# Altium schematic sheet POWER_RAIL.SchDoc
size A3
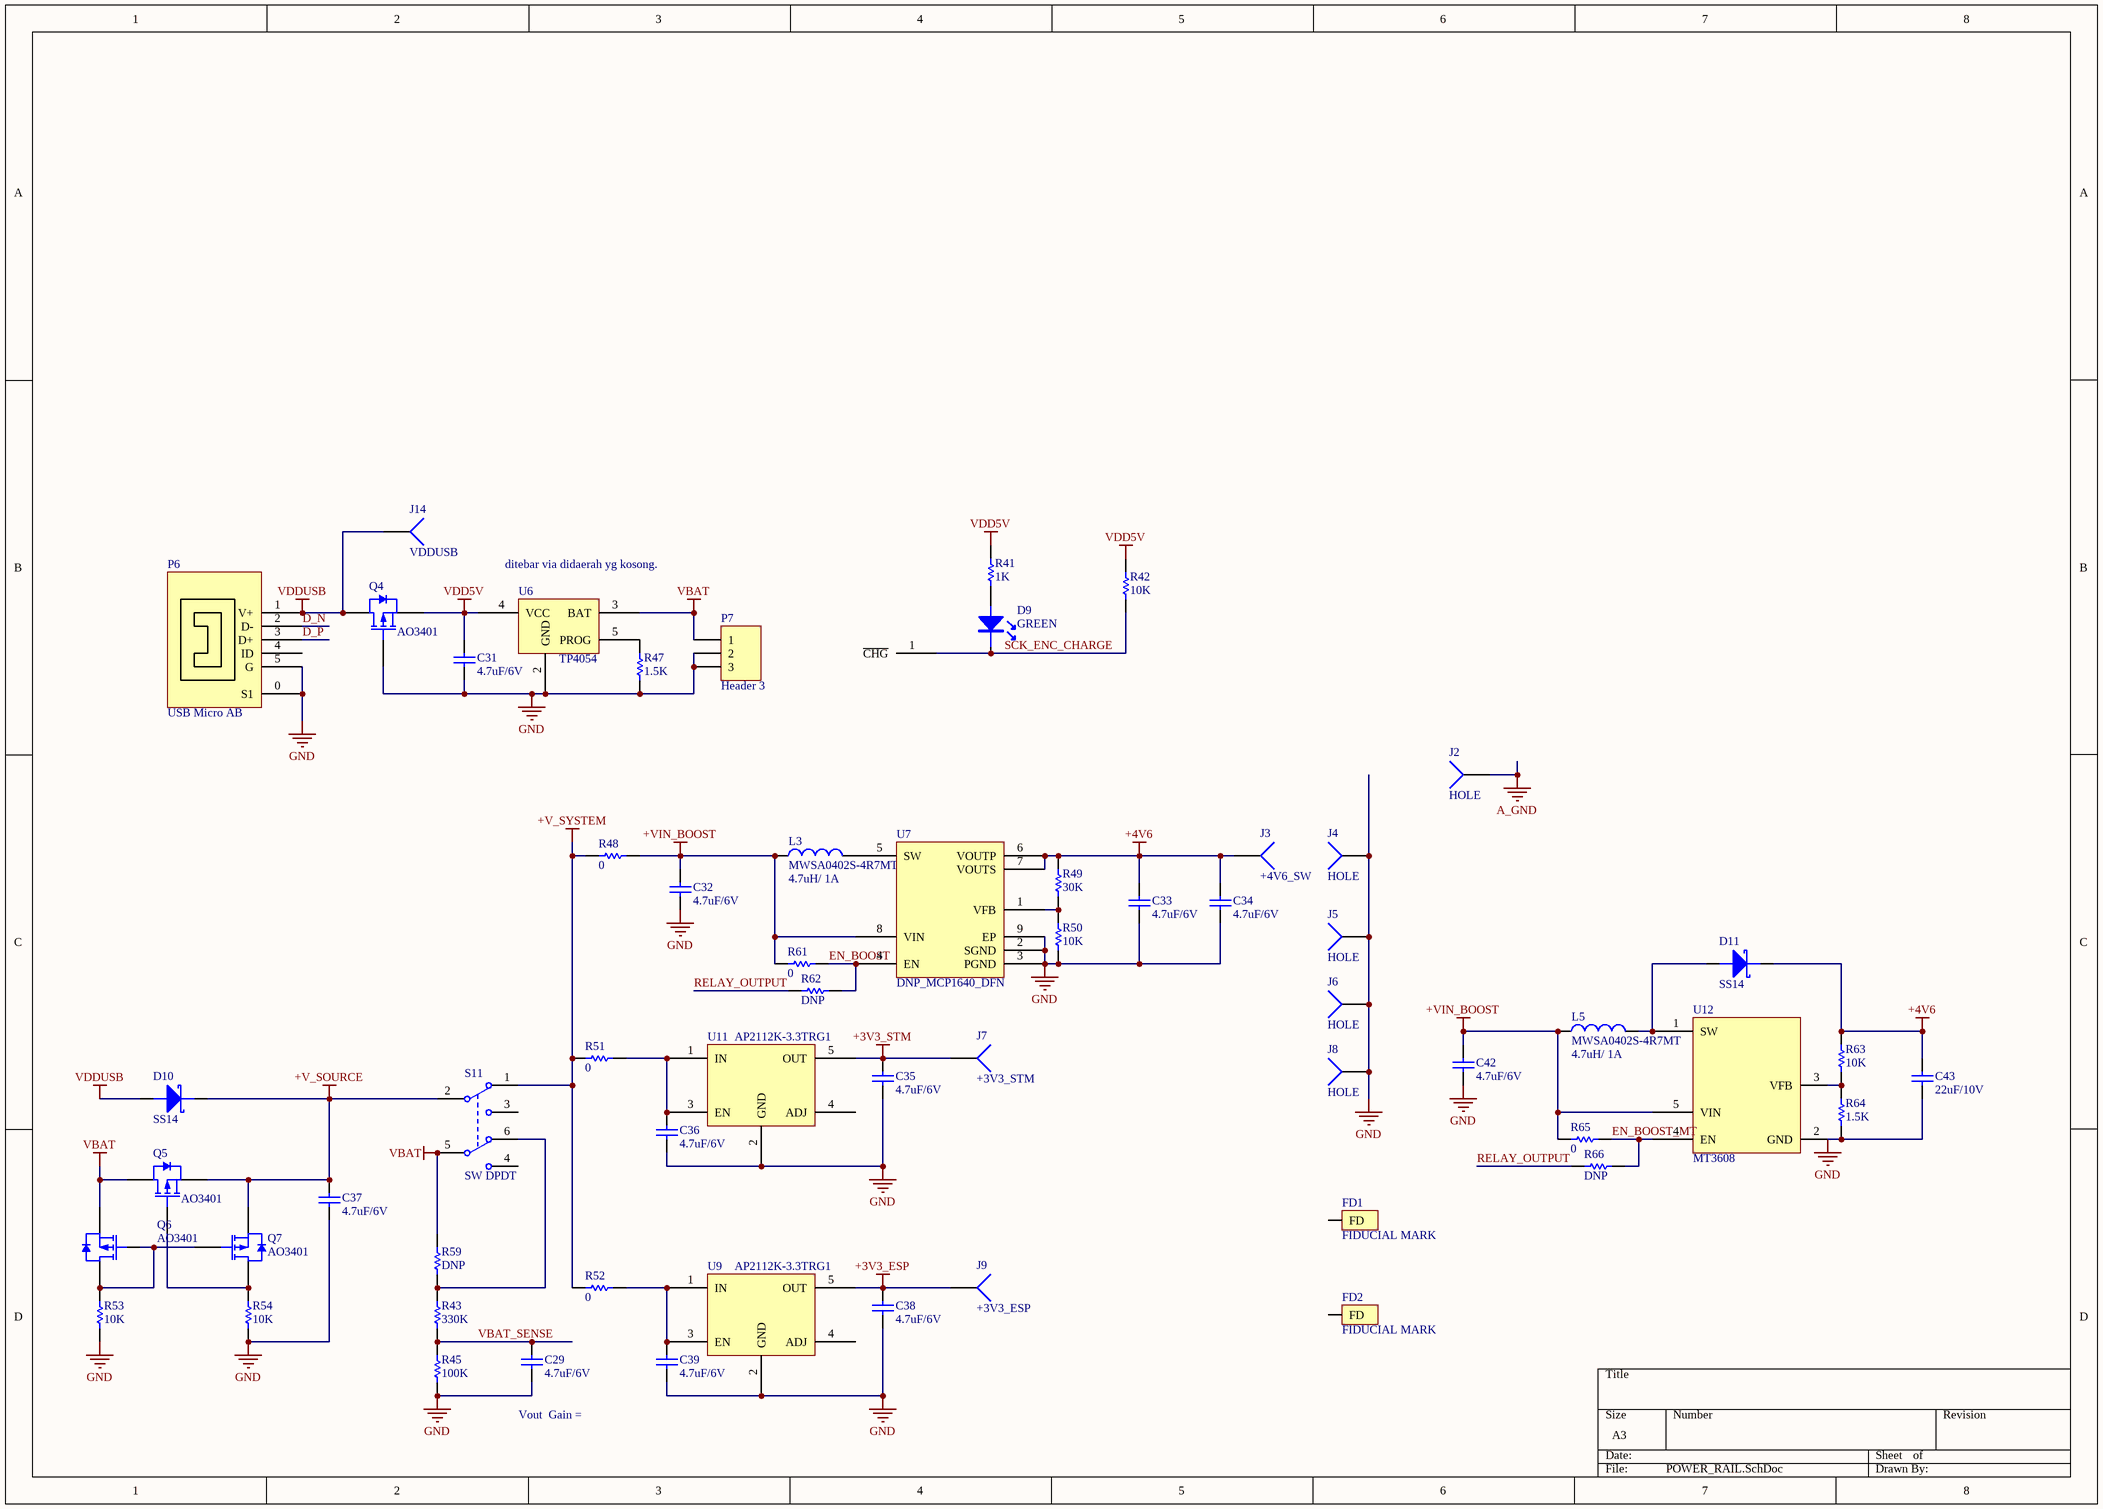
[diagram p0: POWER_RAIL.SchDoc]

## Parts
C29  4.7uF/6V  [CR2012-0805]
C31  4.7uF/6V  [CR2012-0805]
C32  4.7uF/6V  [CR2012-0805]
C33  4.7uF/6V  [CR2012-0805]
C34  4.7uF/6V  [CR2012-0805]
C35  4.7uF/6V  [CR2012-0805]
C36  4.7uF/6V  [CR2012-0805]
C37  4.7uF/6V  [CR2012-0805]
C38  4.7uF/6V  [CR2012-0805]
C39  4.7uF/6V  [CR2012-0805]
C42  4.7uF/6V  [CR2012-0805]
C43  22uF/10V  [CR3216-1206]
D9  GREEN  [LED1206]
D10  SS14  [DO-214AC (SMA)]
D11  SS14  [DO-214AC (SMA)]
FD1  FIDUCIAL MARK  [FIDU-ROUND]
FD2  FIDUCIAL MARK  [FIDU-ROUND]
J2  HOLE  [HOLE_45MM]
J3  +4V6_SW  [PIN1]
J4  HOLE  [HOLE_45MM]
J5  HOLE  [HOLE_45MM]
J6  HOLE  [HOLE_45MM]
J7  +3V3_STM  [PIN1]
J8  HOLE  [HOLE_45MM]
J9  +3V3_ESP  [PIN1]
J14  VDDUSB  [PIN1]
L3  MWSA0402S-4R7MT  value 4.7uH/ 1A  [IND4X4MM]
L5  MWSA0402S-4R7MT  value 4.7uH/ 1A  [IND4X4MM]
P6  USB Micro AB  [USB_MICRO_wi_LEG]
P7  Header 3  [Molex 3p Male]
Q4  AO3401  [SOT-23-3]
Q5  AO3401  [SOT-23-3]
Q6  AO3401  [SOT-23-3]
Q7  AO3401  [SOT-23-3]
R41  1K  [CR2012-0805]
R42  10K  [CR2012-0805]
R43  330K  [CR2012-0805]
R45  100K  [CR2012-0805]
R47  1.5K  [CR2012-0805]
R48  0  [JP1_SMD]
R49  30K  [CR2012-0805]
R50  10K  [CR2012-0805]
R51  0  [JP1_SMD]
R52  0  [JP1_SMD]
R53  10K  [CR2012-0805]
R54  10K  [CR2012-0805]
R59  DNP  [JP1_SMD]
R61  0  [JP1_SMD]
R62  DNP  [JP1_SMD]
R63  10K  [CR2012-0805]
R64  1.5K  [CR2012-0805]
R65  0  [JP1_SMD]
R66  DNP  [JP1_SMD]
S11  SW DPDT  [SWITCH_SPDT]
U6  TP4054  [SOT23-5]
U7  DNP_MCP1640_DFN  [DFN-8_2X3]
U9  AP2112K-3.3TRG1  [SOT-23-5]
U11  AP2112K-3.3TRG1  [SOT-23-5]
U12  MT3608  [SOT-23-6]

## Nets
+3V3_ESP: C38.2 J9.1 U9.5(OUT)
+3V3_STM: C35.2 J7.1 U11.5(OUT)
+4V6: C33.2 C34.2 C43.2 D11.2(K) J3.1 R49.2 R63.2 U7.6(VOUTP) U7.7(VOUTS)
+V_SOURCE: C37.2 D10.2(K) Q5.2(S) Q7.2(S) S11.2(COMMON1)
+V_SYSTEM: R48.1 R51.1 R52.1 S11.1(NC1)
+VIN_BOOST: C32.2 C42.2 L3.1 L5.1 R48.2 R61.1 R65.1 U7.8(VIN) U12.5(VIN)
A_GND: J2.1
GND: C29.1 C31.1 C32.1 C33.1 C34.1 C35.1 C36.1 C37.1 C38.1 C39.1 C42.1 C43.1 J4.1 J5.1 J6.1 J8.1 P6.0(S1) P6.5(G) P7.2 P7.3 Q4.1(G) R45.1 R47.1 R50.1 R53.1 R54.1 R64.1 U6.2(GND) U7.2(SGND) U7.3(PGND) U7.9(EP) U9.2(GND) U11.2(GND) U12.2(GND)
VBAT: P7.1 Q5.3(D) Q6.2(S) R59.2 S11.5(COMMON2) U6.3(BAT)
VDD5V: C31.2 Q4.2(S) R41.2 R42.2 U6.4(VCC)
VDDUSB: D10.1(A) J14.1 P6.1(V+) Q4.3(D)
D_N: P6.2(D-)
D_P: P6.3(D+)
EN_BOOST: R61.2 R62.1 U7.4(EN)
EN_BOOST_MT: R65.2 R66.1 U12.4(EN)
RELAY_OUTPUT: R62.2 R66.2
SCK_ENC_CHARGE: D9.K R42.1 U6.1(~{CHG})
VBAT_SENSE: C29.2 R43.1 R45.2
NetC36_2: C36.2 R51.2 U11.1(IN) U11.3(EN)
NetC39_2: C39.2 R52.2 U9.1(IN) U9.3(EN)
NetD9_A: D9.A R41.1
NetD11_1: D11.1(A) L5.2 U12.1(SW)
NetL3_2: L3.2 U7.5(SW)
NetQ5_1: Q5.1(G) Q7.3(D) R54.2
NetQ6_1: Q6.1(G) Q6.3(D) Q7.1(G) R53.2
NetR43_2: R43.2 R59.1 S11.6(NO2)
NetR47_2: R47.2 U6.5(PROG)
NetR49_1: R49.1 R50.2 U7.1(VFB)
NetR63_1: R63.1 R64.2 U12.3(VFB)

Not connected (* = marked no-connect by the designer): FD1 1(FD); FD2 1(FD); P6 4(ID); S11 3(NO1) 4(NC2); U9 4(ADJ); U11 4(ADJ)

## Notes on the sheet
- (near U6) ditebar via didaerah yg kosong.
- (near C29) Vout  Gain =

## Library data of the parts
C29 C31-C39 C42 C43 = Cap Semi: Capacitor (Semiconductor SIM Model); Published: 8-Jun-2000; LatestRevisionDate: 29-May-2009; LatestRevisionNote: IPC-7351 Footprint Added.; PackageReference: C1206; Publisher: Altium Limited; PackageDescription: Chip Capacitor; Unit Price: 0.15
  C29 C31-C39 C42: Value: 4.7uF/6V
  C43: Value: 22uF/10V
D9 = SMT_LED_0603: SMT LED
D10 D11 = DIODE SCHOTTKY: Schottky Barrier Diodes; Manufacturer Part Number: SS18; Package / Case: SMA (DO-214AC)
FD1 FD2 = FIDU: 0.5mm fiducial marking with 1mm solder expansion
J2-J9 J14 = Socket: LatestRevisionDate: 17-Jul-2002; LatestRevisionNote: Re-released for DXP Platform.; Publisher: Altium Limited
L3 L5 = Inductor: Code_IEC: 1005; Published: 8-Jun-2000; LatestRevisionDate: 29-May-2009; LatestRevisionNote: IPC-7351 Footprint Added.; PackageReference: 0402-A; Publisher: Altium Limited; PackageDescription: Chip Inductor; Code_JEITA: 0402
P6 = USB Micro AB: USB Micro AB connector
P7 = Header 3: Header, 3-Pin; LatestRevisionDate: 17-Jul-2002; LatestRevisionNote: Re-released for DXP Platform.; Publisher: Altium Limited
Q4-Q7 = AO3401: 30V P-Channel MOSFET; Published: 17-Sep-2003; PackageVersion: May-1999; PackageReference: SOT23; Publisher: Altium Limited; PackageDescription: 3-Pin SOT-23 Package 0.95 mm Pitch, 2.3 mm Lead Span
R41 R42 R48-R54 R59 R61-R66 = Res Semi: Semiconductor Resistor; Published: 8-Jun-2000; LatestRevisionDate: 17-Jul-2002; LatestRevisionNote: Re-released for DXP Platform.; PackageReference: AXIAL-0.5; Publisher: Altium Limited; Unit Price: 0.15
  R41: Value: 1K
  R42 R50 R53 R54 R63: Value: 10K
  R48 R51 R52 R61 R65: Value: 0
  R49: Value: 30K
  R59 R62 R66: Value: DNP
  R64: Value: 1.5K
R43 R45 = Res Semi: Semiconductor Resistor; Value: 56K; Published: 8-Jun-2000; LatestRevisionDate: 17-Jul-2002; LatestRevisionNote: Re-released for DXP Platform.; PackageReference: AXIAL-0.5; Publisher: Altium Limited; Unit Price: 0.15
R47 = Res Semi: Semiconductor Resistor; Value: 1.6K; Published: 8-Jun-2000; LatestRevisionDate: 17-Jul-2002; LatestRevisionNote: Re-released for DXP Platform.; PackageReference: AXIAL-0.5; Publisher: Altium Limited; Unit Price: 0.15
S11 = SW DPDT: Switch; Published: 24-Mar-1999; LatestRevisionDate: 29-May-2009; LatestRevisionNote: IPC-7351 Footprint Added.; PackageVersion: Mar-2001; PackageReference: SOT23-6; Publisher: Altium Limited; PackageDescription: 6-Pin SOT-23 Package 0.95 mm Pitch, 2.7 mm Lead Span; Code_JEITA: SC-74; Code_IPC: SOT26A-6
U6 = TP4056
U7 = MCP1640_DFN: Synchronous Boost Regulator with True Output Disconnect or Input/Output Bypass Option
U9 U11 = AP7311: IC REG LDO ADJ .15A SOT25-5; Manufacturer: Diodes Inc; Manufacturer Part Number: AP7311-18WG-7; Current - Limit (Min): 200mA; Number of Regulators: 1; Current - Output: 150mA (Max); Voltage - Input: 2 V ~ 6 V; Voltage - Output: 1.8V; Regulator Topology: Positive Fixed; Supplier Device Package: SOT-25; Package / Case: SC-74A, SOT-753; Mounting Type: Surface Mount; Operating Temperature: -40°C ~ 85°C; Category: Integrated Circuits (ICs); Voltage - Dropout (Typical): -; Supplier: Digi-Key; Packaging: Cut Tape (CT); RoHS: RoHS Compliant; Supplier Part Number: AP2112K-3.3TRG1; ComponentLink1URL: http://www.diodes.com/datasheets/AP7311.pdf; ComponentLink1Description: http://www.diodes.com/datasheets/AP7311.pdf; Pricing: 1=0.5, 10=0.394, 25=0.3324, 100=0.2708, 250=0.22424, 500=0.18526, 1000=0.13875 (USD); Stock: 7183
U12 = MT3608: Synchronous Boost Regulator with True Output Disconnect or Input/Output Bypass Option